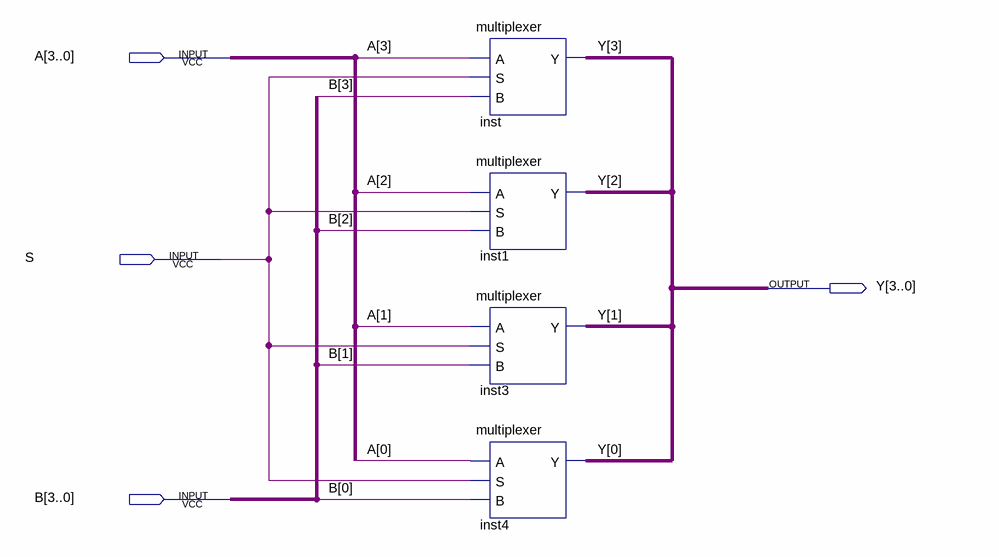
[diagram p0: schematic sheet]
// Quartus schematic mux4.bdf as structural Verilog: 4 symbols, 4 pins
module mux4 (
  input  [3:0] A,
  input  S,
  input  [3:0] B,
  output [3:0] Y
);

  multiplexer inst (.A(A[3]), .S(S), .B(B[3]), .Y(Y[3]));
  multiplexer inst1 (.A(A[2]), .S(S), .B(B[2]), .Y(Y[2]));
  multiplexer inst3 (.A(A[1]), .S(S), .B(B[1]), .Y(Y[1]));
  multiplexer inst4 (.A(A[0]), .S(S), .B(B[0]), .Y(Y[0]));
endmodule
